# EAGLE schematic ASL2111 (EAGLE 6.2)
DATABASE: ./../../../../../Components/TinyCircuits_Part_Database.txt
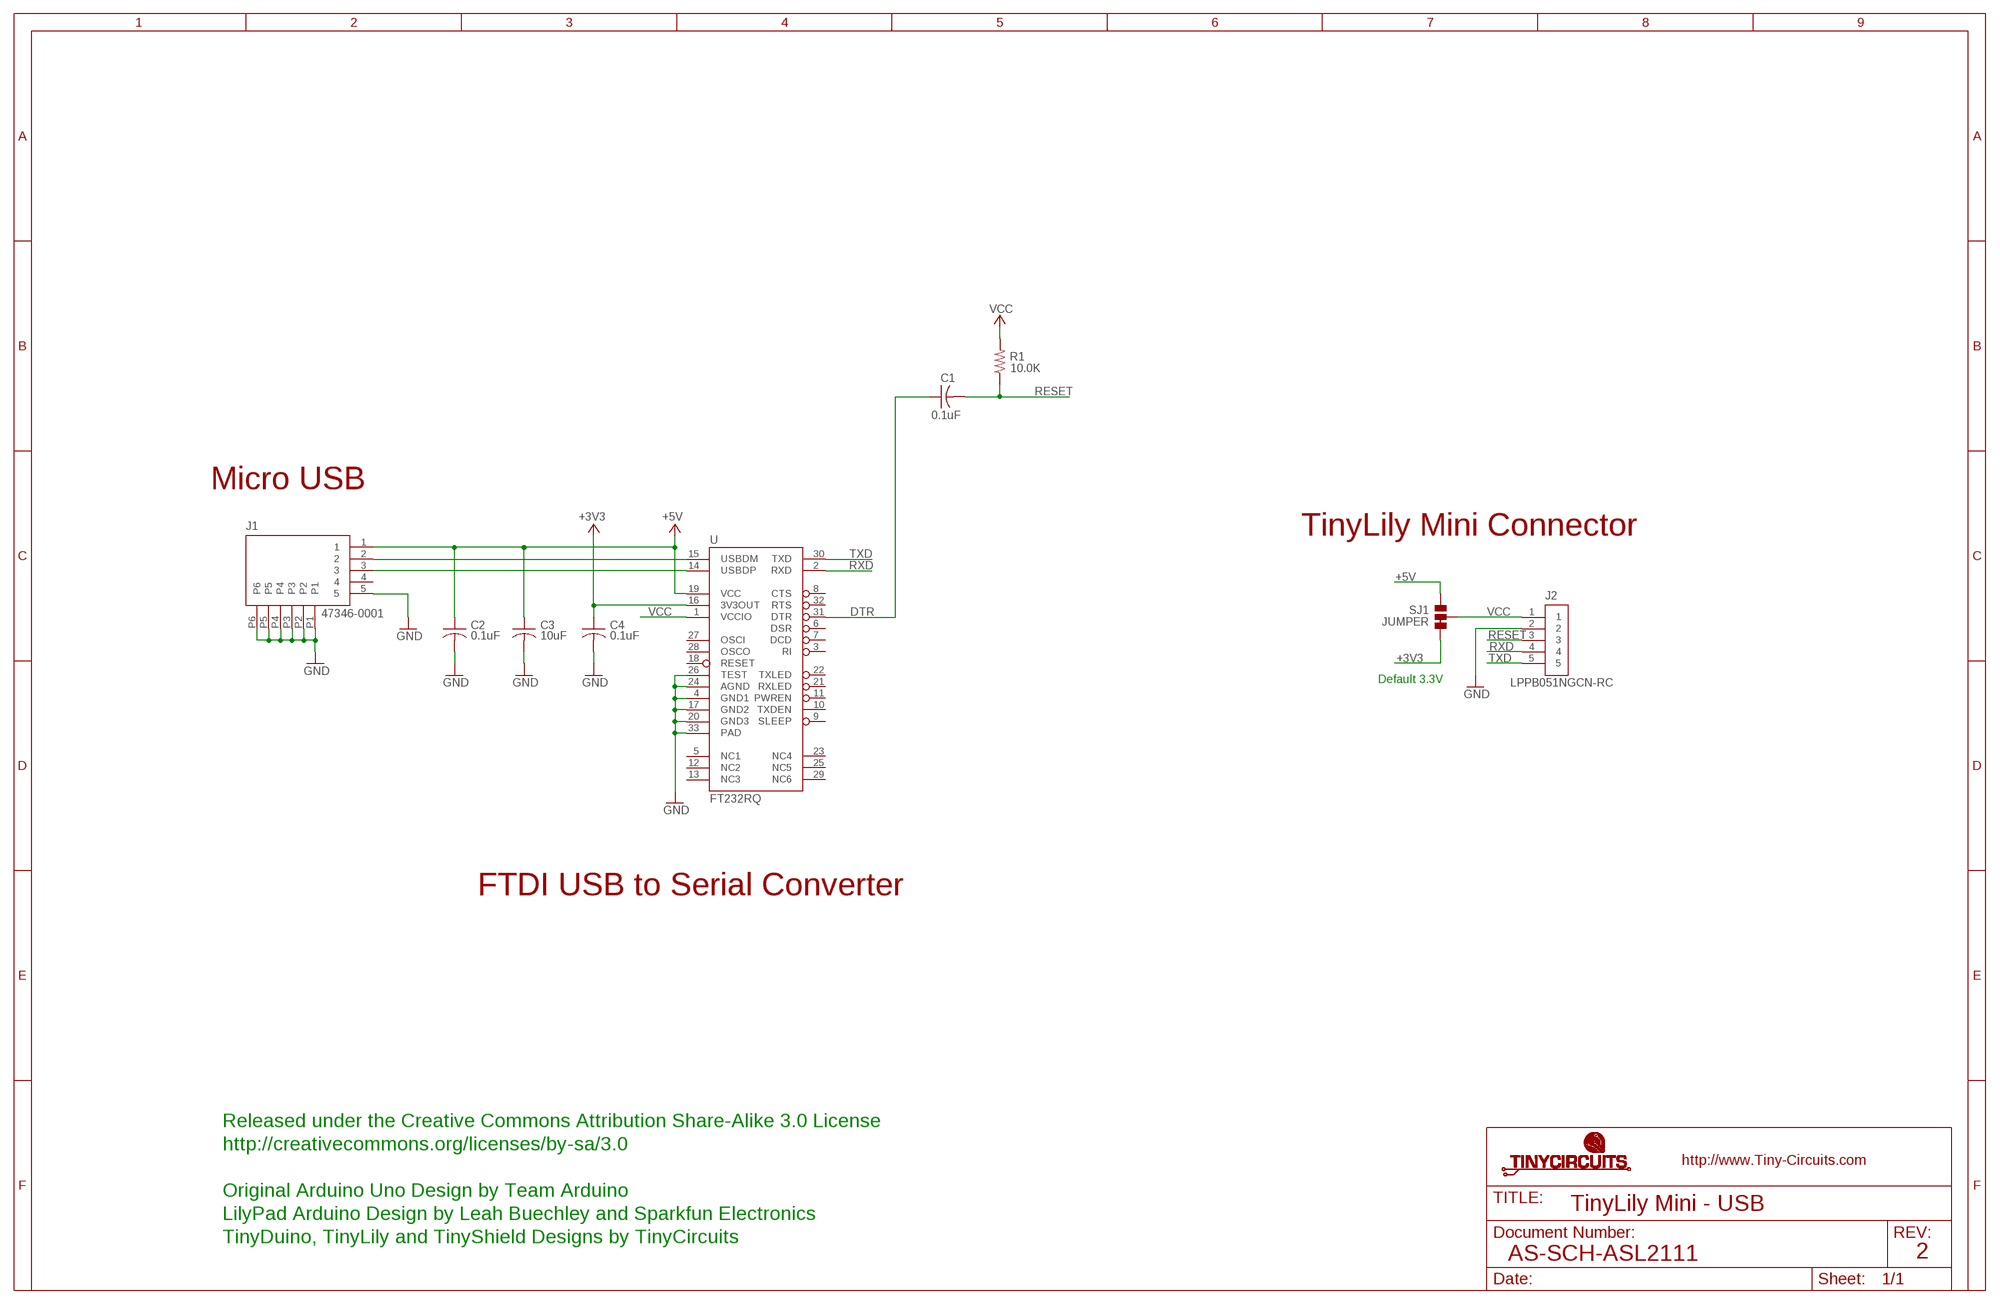
[diagram p0: schematic, sheet 1]

## Parts
C1  0.1uF  AS-ITM-00008  [C0402]
C2  0.1uF  AS-ITM-00008  [C0402]
C3  10uF  AS-ITM-00002  [C0603]
C4  0.1uF  AS-ITM-00008  [C0402]
J1  47346-0001  AS-ITM-00021  [MICRO_USB]
J2  LPPB051NGCN-RC  AS-ITM-00037  [1X5_.05_RA_TH_RECPT]
R1  10.0K  AS-ITM-00032  [0402]
SJ1  JUMPER  AS-ITM-00033  [JUMPER_0402]
U  FT232RQ  AS-ITM-00029  [MLF32]

## Nets
+3V3: C4.1 SJ1.2 U.16(3V3OUT)
+5V: C2.1 C3.1 J1.1 SJ1.3 U.19(VCC)
DTR: C1.1 U.31(DTR)
GND: C2.2 C3.2 C4.2 J1.5 J1.P1 J1.P2 J1.P3 J1.P4 J1.P5 J1.P6 J2.2 U.4(GND1) U.17(GND2) U.20(GND3) U.24(AGND) U.26(TEST) U.33(PAD)
N$5: J1.2 U.15(USBDM)
N$6: J1.3 U.14(USBDP)
RESET: C1.2 J2.3 R1.1
RXD: J2.4 U.2(RXD)
TXD: J2.5 U.30(TXD)
VCC: J2.1 R1.2 SJ1.1 U.1(VCCIO)
Unconnected: J1.4 U.3(RI) U.5(NC1) U.6(DSR) U.7(DCD) U.8(CTS) U.9(SLEEP) U.10(TXDEN) U.11(PWREN) U.12(NC2) U.13(NC3) U.18(RESET) U.21(RXLED) U.22(TXLED) U.23(NC4) U.25(NC5) U.27(OSCI) U.28(OSCO) U.29(NC6) U.32(RTS)

## Notes on the sheet
- Micro USB
- TinyLily Mini Connector
- Default 3.3V
- FTDI USB to Serial Converter
- Released under the Creative Commons Attribution Share-Alike 3.0 License
- http://creativecommons.org/licenses/by-sa/3.0
- Original Arduino Uno Design by Team Arduino
- TinyLily Mini - USB
- LilyPad Arduino Design by Leah Buechley and Sparkfun Electronics
- TinyDuino, TinyLily and TinyShield Designs by TinyCircuits
- AS-SCH-ASL2111 | 2

## Library data of the parts
C1 C2 C4 = tinycircuits:AS-ITM-00008: CAP CER 0.1UF 10V 10% X5R 0402; PARTNO: AS-ITM-00008
C3 = tinycircuits:AS-ITM-00002: CAP CER 10UF 10V 20% X5R 0603; PARTNO: AS-ITM-00002
J1 = tinycircuits:AS-ITM-00021: CONN RCPT 5POS MICRO USB R/A; PARTNO: AS-ITM-00021
J2 = tinycircuits:AS-ITM-00037: CONN HEADER .050" 5POS TH RA RECPT; PARTNO: AS-ITM-00037
R1 = tinycircuits:AS-ITM-00032: RES 10.0K OHM 1/16W 1% 0402 SMD; PARTNO: AS-ITM-00032
SJ1 = tinycircuits:AS-ITM-00033: JUMPER 0402; PARTNO: AS-ITM-00033
U = tinycircuits:AS-ITM-00029: IC USB FS SERIAL UART 32-QFN; PARTNO: AS-ITM-00029

## Net classes
2 gnd: width 0.305 mm, drill 0.559 mm, clearance 0.254 mm